# EAGLE design Adafruit SMT Datalogger Shield (EAGLE 6.4)
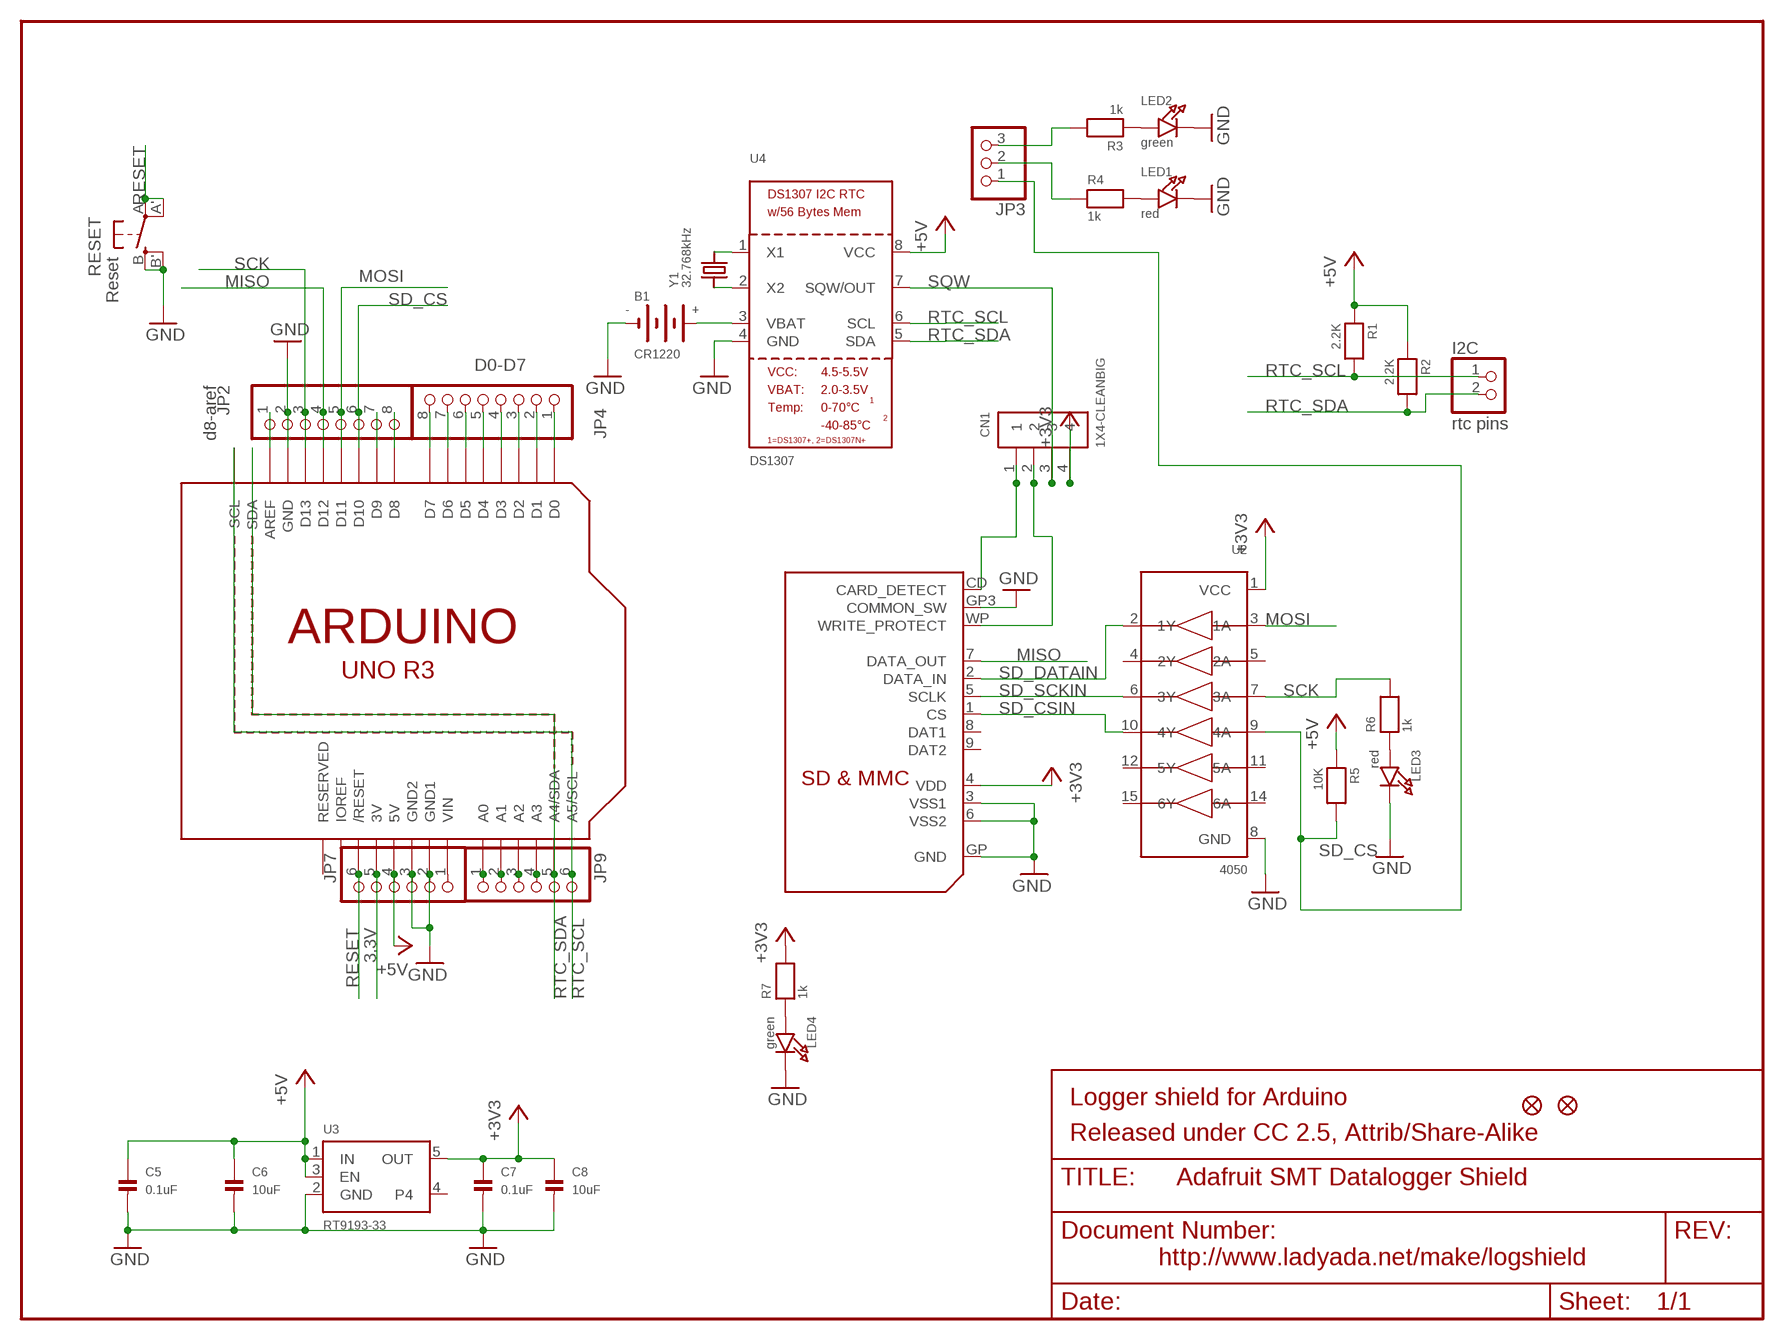
[diagram p0: schematic, sheet 1]

## Parts
B1  CR1220  BATTERYCR1220_SMT  [CR1220]
C5  0.1uF  CAP_CERAMIC0805  [0805]
C6  10uF  CAP_CERAMIC0805  [0805]
C7  0.1uF  CAP_CERAMIC0805  [0805]
C8  10uF  CAP_CERAMIC0805  [0805]
CN1  1X4-CLEANBIG  [1X04-CLEANBIG]
FID1  FIDUCIAL1X2.5  [FIDUCIAL-1X2.5]
FID3  FIDUCIAL1X2.5  [FIDUCIAL-1X2.5]
I2C  rtc pins  PINHD-1X2  [1X02]
JP2  d8-aref  PINHD-1X8BIG  [1X08-BIG]
JP3  HEADER-1X3ROUND  [1X03_ROUND]
JP4  D0-D7  PINHD-1X8BIG  [1X08-BIG]
JP7  PINHD-1X6B  [1X06-BIG]
JP9  PINHD-1X6B  [1X06-BIG]
LED1  red  LED0805  [CHIPLED_0805]
LED2  green  LED0805  [CHIPLED_0805]
LED3  red  LED0805  [CHIPLED_0805]
LED4  green  LED0805  [CHIPLED_0805]
R1  2.2K  RESISTOR0805  [0805]
R2  2.2K  RESISTOR0805  [0805]
R3  1k  RESISTOR0805  [0805]
R4  1k  RESISTOR0805  [0805]
R5  10K  RESISTOR0805  [0805]
R6  1k  RESISTOR0805  [0805]
R7  1k  RESISTOR0805  [0805]
RESET  Reset  SPST_TACT-EVQQ2  [EVQ-Q2]
U1  ARDUINOR3-DIMENSION  [ARDUINOR3]
U2  4050  74HC4050D  [SOIC16]
U3  RT9193-33  VREG_SOT23-5  [SOT23-5]
U4  DS1307  RTC_DS1307  [SOIC8_150MIL]
U$2  SDMMC06132  [06132]
Y1  32.768kHz  CRYSTAL8X3.8SMT  [CRYSTAL_8X3.8]

## Nets
3.3V: JP7.5 U1.3V
+3V3: C7.1 C8.1 CN1.4 R7.2 U2.1(VCC) U3.5(OUT) U$2.4(VDD)
+5V: C5.1 C6.1 JP7.4 R1.1 R2.1 R5.1 U1.5V U3.1(IN) U3.3(EN) U4.8(VCC)
GND: B1.- C5.2 C6.2 C7.2 C8.2 JP2.2 JP7.2 JP7.3 LED1.C LED2.C LED3.C LED4.C RESET.B'(S1) RESET.B(S) U1.GND U1.GND1 U1.GND2 U2.8(GND) U3.2(GND) U4.4(GND) U$2.3(VSS1) U$2.6(VSS2) U$2.GP3(COMMON_SW) U$2.GP(GND)
MISO: JP2.4 U1.D12 U$2.7(DATA_OUT)
MOSI: JP2.5 U1.D11 U2.3(1A)
N$1: LED1.A R4.2
N$2: U4.2(X2) Y1.P$1
N$3: U4.1(X1) Y1.P$4
N$4: LED2.A R3.1
N$5: LED3.A R6.1
N$14: B1.+$1(+) U4.3(VBAT)
N$15: JP7.1 U1.VIN
N$17: JP3.3 R3.2
N$20: JP3.2 R4.1
N$87: JP4.1 U1.D0
N$88: JP4.2 U1.D1
N$89: JP4.3 U1.D2
N$90: JP4.4 U1.D3
N$98: JP4.5 U1.D4
N$99: JP4.6 U1.D5
N$100: JP4.7 U1.D6
N$101: JP4.8 U1.D7
N$108: JP2.1 U1.AREF
N$110: JP2.7 U1.D9
N$111: JP2.8 U1.D8
N$150: LED4.A R7.1
N$154: JP9.1 U1.A0
N$164: JP9.2 U1.A1
N$181: JP9.3 U1.A2
N$182: JP9.4 U1.A3
RESET: JP7.6 RESET.A'(P1) RESET.A(P) U1.RESET(/RESET)
RTC_SCL: I2C.1 JP9.6 R1.2 U1.A5(A5/SCL) U1.SCL U4.6(SCL)
RTC_SDA: I2C.2 JP9.5 R2.2 U1.A4(A4/SDA) U1.SDA U4.5(SDA)
SCK: JP2.3 R6.2 U1.D13 U2.7(3A)
SD_CD: CN1.1 U$2.CD(CARD_DETECT)
SD_CS: JP2.6 JP3.1 R5.2 U1.D10 U2.9(4A)
SD_CSIN: U2.10(4Y) U$2.1(CS)
SD_DATAIN: U2.2(1Y) U$2.2(DATA_IN)
SD_SCKIN: U2.6(3Y) U$2.5(SCLK)
SD_WP: CN1.2 U$2.WP(WRITE_PROTECT)
SQW: CN1.3 U4.7(SQW/OUT)
Unconnected: U1.IOREF U1.RESERVED U2.4(2Y) U2.5(2A) U2.11(5A) U2.12(5Y) U2.14(6A) U2.15(6Y) U3.4 U$2.8(DAT1) U$2.9(DAT2)

## Notes on the sheet
- Logger shield for Arduino
- Released under CC 2.5, Attrib/Share-Alike
- http://www.ladyada.net/make/logshield

## Library data of the parts
B1 = microbuilder:BATTERY
C5-C8 = microbuilder:CAP_CERAMIC: Ceramic Capacitors 0402 - 0402 Surface Mount Capacitors 16pF 50V 5% [Digikey: 445-4899-2-ND] 18pF 50V 5% [Digikey: 490-1281-2-ND] 22pF 50V 5% [Digikey: 490-1283-2-ND] 68pF 50V 5% [Digikey: 490-1289-2-ND] 0.1uF 10V 10% [Digikey: 490-1318-2-ND] 1.0uF 6.3V 10% [Digikey: 490-1320-2-ND] 0603 - 0603 Surface Mount Capacitors 16 pF 50V 5% [Digikey: 445-5051-2-ND] 22 pF 50V [Digikey: PCC220ACVTR-ND] 33 pF 50V 5% [Digikey: 490-1415-1-ND] 56pF 50V 5% [Digikey: 490-1421-1-ND] 220pF 50V 5% [Digikey: 445-1285-1-ND] 680 pF 50V 2200 pF 50V 5% C0G [Digikey: 445-1297-1-ND] 5600 pF 100V 5% X7R [Digikey: 478-3711-1-ND] 0.1 µF 25V 10% [Digikey: PCC2277TR-ND] 0.22 µF 16V 10% X7R [Digikey: 445-1318-1-ND] 1.0 µF 25V 10% [Digikey: 445-5146-2-ND] 0603 - RF Specific 3pF 250V +/-0.1pF RF [Digikey: 712-1347-1-ND] 18 pF 250V 5% [Digikey: 478-3505-1-ND or 712-1322-1-ND] 56 pF 250V 5% C0G RF [Digikey: 490-4867-1-ND] 68 pF 250V RF [Digikey: 490-4868-1-ND] 0805 - 0805 Surface Mount Capacitors 220 pF 250V 2% RF Ceramic Capacitor [Digikey: 712-1398-1-ND] 1000 pF 50V 2% NP0 Ceramic Capacitor [Digikey: 478-3760-1-ND] 0.1 µF 25V 10% Ceramic Capacitor [Digikey: PCC1828TR-ND] 1.0 µF 16V 10% Ceramic Capacitor[Digikey: 490-1691-2-ND] 10.0 µF 10V 10% Ceramic Capacitor[Digikey: 709-1228-1-ND] 10.0 uF 16V 10% Ceramic Capacitor [Digikey: 478-5165-2-ND] 47 uF 6.3V 20% Ceramic Capacitor [Digikey: 587-1779-1-ND or 399-5506-1-ND] 1206 - 1206 Surface Mount Capacitors 47uF 10V 20% Ceramic Capacitor [Digikey: 490-5528-1-ND or 399-5508-1-ND or 445-6010-1-ND] 100uF 6.3V -20%, +80% Y5V Ceramic Capacitor (Digikey: 490-4512-1-ND, Mouser: 81-GRM31CF50J107ZE1L)
CN1 = adafruit:1X4: 4-pin connector
FID1 FID3 = microbuilder:FIDUCIAL: Fiducial Alignment Points Various fiducial points for machine vision alignment.
I2C = pinhead:PINHD-1X2: PIN HEADER
JP2 JP4 = adafruit:PINHD-1X8: PIN HEADER
JP3 = microbuilder:HEADER-1X3: PIN HEADER
JP7 JP9 = adafruit:PINHD-1X6: PIN HEADER
LED1-LED4 = microbuilder:LED: LED 0603 - 0603 Surface Mount Package 2mA: Green LED - Low Power (3.9mcd, 2ma, 1.7Vf) - Digikey: 475-2709-2-ND Orange LED - Low Power (9.8mcd, 2ma, 1.8Vf) - Digikey: 475-1194-2-ND Red LED - Low Power (5mcd, 2ma, 1.8Vf) - Digikey: 475-1195-2-ND Yellow LED - Low Power (7mcd, 2ma, 1.8Vf) - Digikey: 475-1196-2-ND 5mA: Blue LED - Low Power (17mcd, 5ma, 2.9Vf) - Digikey: LNJ937W8CRACT-ND 0805 - 0805 Surface Mount Package 2mA: Red LED (8.8mcd, 2mA, 1.8Vf, Clear) - Low Power [Digikey: 475-2510-1-ND] Green LED (5mcd, 2mA, 1.8Vf, Clear) - Low Power [Digikey: 475-2730-1-ND] Yellow LED (11.3mcd, 2mA, 1.8Vf, Clear) - Low Power [Digikey: 475-2555-1-ND] 20mA: Red LED (104mcd, 20mA, Diffused) - LS R976 [Digikey: 475-1278-6-ND] Red LED (12mcd, 20mA, 2.0Vf, Clear) - APT2012EC [Digikey: 754-1128-1-ND] Green LED (15mcd, 20mA, 2.2Vf, Clear) - APT2012GC [Digikey: 754-1131-1-ND] Orange LED (160mcd, 20mA, 2.1Vf, Clear) - APT2012SECK [Digikey: 754-1130-1-ND] 1206 - 1206 Surface Mount Package Green LED (26mcd, 20mA, Diffused) - LG N971 [Digikey: 475-1407-6-ND] Red LED (15mcd, 20mA, Diffused) - LH N974 [Digikey: 475-1416-6-ND]
R1-R7 = microbuilder:RESISTOR: Resistors 0402 - 0402 Surface Mount Package 22 Ohm 1% 1/16W [Digikey: 311-22.0LRTR-ND] 33 Ohm 5% 1/16W 1.0K 5% 1/16W 1.5K 5% 1/16W 2.0K 1% 1/16W 10.0K 1% 1/16W [Digikey: 311-10.0KLRTR-ND] 10.0K 5% 1/16W [Digikey: RMCF0402JT10K0TR-ND] 12.1K 1% 1/16W [Digikey: 311-22.0LRTR-ND] 100.0K 5% 1/16W 0603 - 0603 Surface Mount Package 0 Ohm 1/10 Watt 1% Resistor 15 Ohm 1/10 Watt 1% Resistor 33 Ohm 1/10 Watt 1% Resistor 49.9 Ohm 1/10 Watt 1% Resistor 100 Ohm 1/10 Watt 1% Resistor 150 Ohm 1/10 Watt 1% Resistor 240 Ohm 1/10 Watt 1% Resistor 390 Ohm 1/10 Watt 1% Resistor 560 Ohm 1/10 Watt 1% Resistor 680 Ohm 1/10 Watt 1% Resistor 750 Ohm 1/10 Watt 1% Resistor 1.0K Ohm 1/10 Watt 1% Resistor 1.5K Ohm 1/10 Watt 1% Resistor 2.0K Ohm 1/10 Watt 1% Resistor 2.2K Ohm 1/10 Watt 1% Resistor 3.3K Ohm 1/10 Watt 1% Resistor 4.7K Ohm 1/10 Watt 1% Resistor 10.0K Ohm 1/10 Watt 1% Resistor 12.0K Ohm 1/10 Watt 1% Resistor 12.1K Ohm 1/10 Watt 1% Resistor 20.0K Ohm 1/10 Watt 1% Resistor 33.0K Ohm 1/10 Watt 1% Resistor 100.0K Ohm 1/10 Watt 1% Resistor 0805 - 0805 Surface Mount Package 0 Ohm 1/8 Watt 1% Resistor 33 Ohm 1/8 Watt 1% Resistor 100 Ohm 1/8 Watt 1% Resistor 150 Ohm 1/8 Watt 1% Resistor 200 Ohm 1/8 Watt 1% Resistor 240 Ohm 1/8 Watt 1% Resistor 330 Ohm 1/8 Watt 1% Resistor 390 Ohm 1/8 Watt 1% Resistor 470 Ohm 1/8 Watt 1% Resistor 1.0K Ohm 1/8 Watt 1% Resistor 1.5K Ohm 1/8 Watt 1% Resistor 2.0K Ohm 1/8 Watt 1% Resistor 4.7K Ohm 1/8 Watt 1% Resistor 5.1K Ohm 1/8 Watt 1% Resistor 5.6K Ohm 1/8 Watt 1% Resistor 10.0K Ohm 1/8 Watt 1% Resistor 22.0K Ohm 1/8 Watt 1% Resistor 33.0K Ohm 1/8 Watt 1% Resistor 100K Ohm 1/8 Watt 1% Resistor 1206 - 1206 Surface Mount Package 2012 - 2010 Surface Mount Package 0.11 Ohm 1/2 Watt 1% Resistor - Digikey: RHM.11UCT-ND
RESET = adafruit:SPST_TACT: SMT 6mm switch, EVQQ2 series http://www.ladyada.net/library/eagle
U1 = adafruit:ARDUINOR3: This is a new object for the new Arduino R3 - with extra pins that you may want to use (such as IOref, and duplicated A4/A5
U2 = microbuilder:74HC4050D: 6-channel level shifter 74HC4050D - 2V-6V Supply Digikey: 74HC4050D,653-ND Mouser: 771-74HC4050D-T
U3 = microbuilder:VREG_SOT23-5: SOT23-5 Fixed Voltage Regulators To better organise some of the SOT23-5 fixed voltage regulators in this library, this new part was created. Part Current Out V Out V In V Dropout Digikey Part No. ADP121 150mA 3.3V 3.4-5.5V 0.09V @ 150mA ADP121-AUJZ33R7CT-ND ADP121 150mA 3.0V 3.1-5.5V 0.09V @ 150mA ADP121-AUJZ30R7CT-ND ADP122 300mA 3.3V 3.4-5.5V 0.085V @ 300mA ADP122AUJZ-3.3-R7CT-ND ADP1712 300mA 3.3V 3.5-5.5V 0.17V @ 300mA ADP1712AUJZ-3.3-R7TR-ND AP7311 (Low Cost) 150mA 3.3V 3.5-6V 0.15V @ 150mA AP7311-33WG-7DICT-ND LD39015M18R 150mA 1.8V 1.9V-5.5V 0.08V @ 100mA 497-6977-1-ND MCP1824T-3302E/OT 300mA 3.3V 3.5V-6V 0.2V @ 300mA MCP1824T-3302E/OTCT-ND MIC5205-2.5YM5 TR 150mA 2.5V 2.7-16V 0.165V @ 150mA 576-1257-2-ND MIC5205-3.0YM5 TR 150mA 3.0V 3.2V-16V 0.165V @ 150mA 576-1258-2-ND MIC5205-3.3YM5 TR 150mA 3.3V 3.5V-16V 0.165V @ 150mA 576-1259-2-ND TPS780330220 150mA 3.3V+2.2V 3.6-5.5V 250mV Max 296-23332-1-ND TDA3663/N1,135 100mA 3.3V 3.5-45V 0.18V @ 50mA 568-5343-1-ND
U4 = microbuilder:RTC_DS1307: DS1307 I2C RTC with 56-Bytes RAM
U$2 = adafruit:SDMMC: SD MMC Card holder 4UCON part #06132 - easy to solder
Y1 = microbuilder:CRYSTAL: Crystals HC49UP - Surface Mount Crystal 4.0MHz 18pF +/-30ppm Surface Mount Crystal [Digikey: 535-9857-1-ND] 12.0 MHz Surface Mount Crystal [Digikey: 535-9869-6-ND] 25.0 MHz Surface Mount Crystal [Digikey: 535-9078-1-ND] 3.2 x 2.5mm - MEMs SMT Crystal 12.0 MHz 8pF 15ppm 3.2 x 2.5mm Crystal [Digikey: -10-70°C: 644-1047-1-ND -40-125°C: 644-1128-1-ND] 16.0 MHz 8pF 15ppm 3.2 x 2.5mm Crystal [Digikey: -10-70°C: 644-1049-1-ND -40-125°C: 644-1129-2-ND] 16.0 MHz 10pF 10ppm 3.2 x 2.5mm Crystal [Digikey: 644-1100-1-ND] 27.12 MHz 18pF 30ppm 3.2 x 2.5mm Crystal [Digikey: 887-1424-1-ND] 27.12MHz 10pF 10ppm 3.2 x 2.5mm Crystal [Digikey: 887-1329-1-ND] 4.9 x 1.8mm - MEMs SMT Crystal 32.768 KHz 12.5pF 20ppm 4.9 x 1.8mm Crystal [Digikey: SE2415CT-ND] 8.0 x 3.8mm - Surface Mount Crystal 32.768kHz 12.5pF 20ppm -40°C-85°C [Digikey: 535-9166-2-ND] Cylinder 32.768KHz Cylinder Crystal (2x6mm body) [Ex. Digikey: 300-8341-2-ND]

## Board
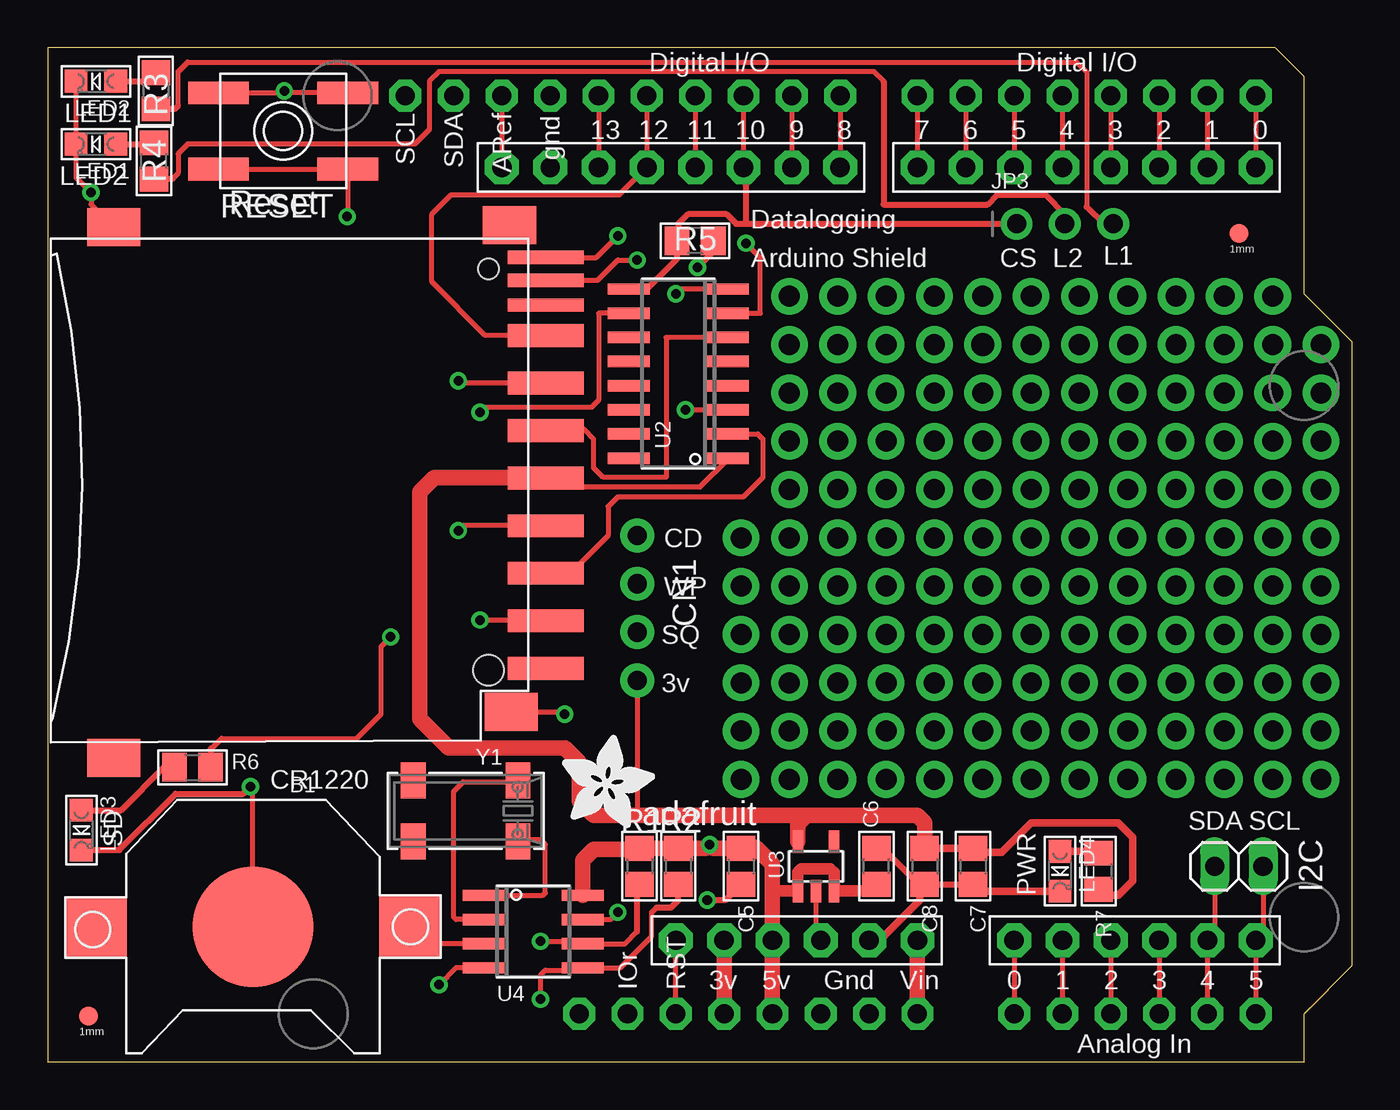
[diagram p1: board, top side]
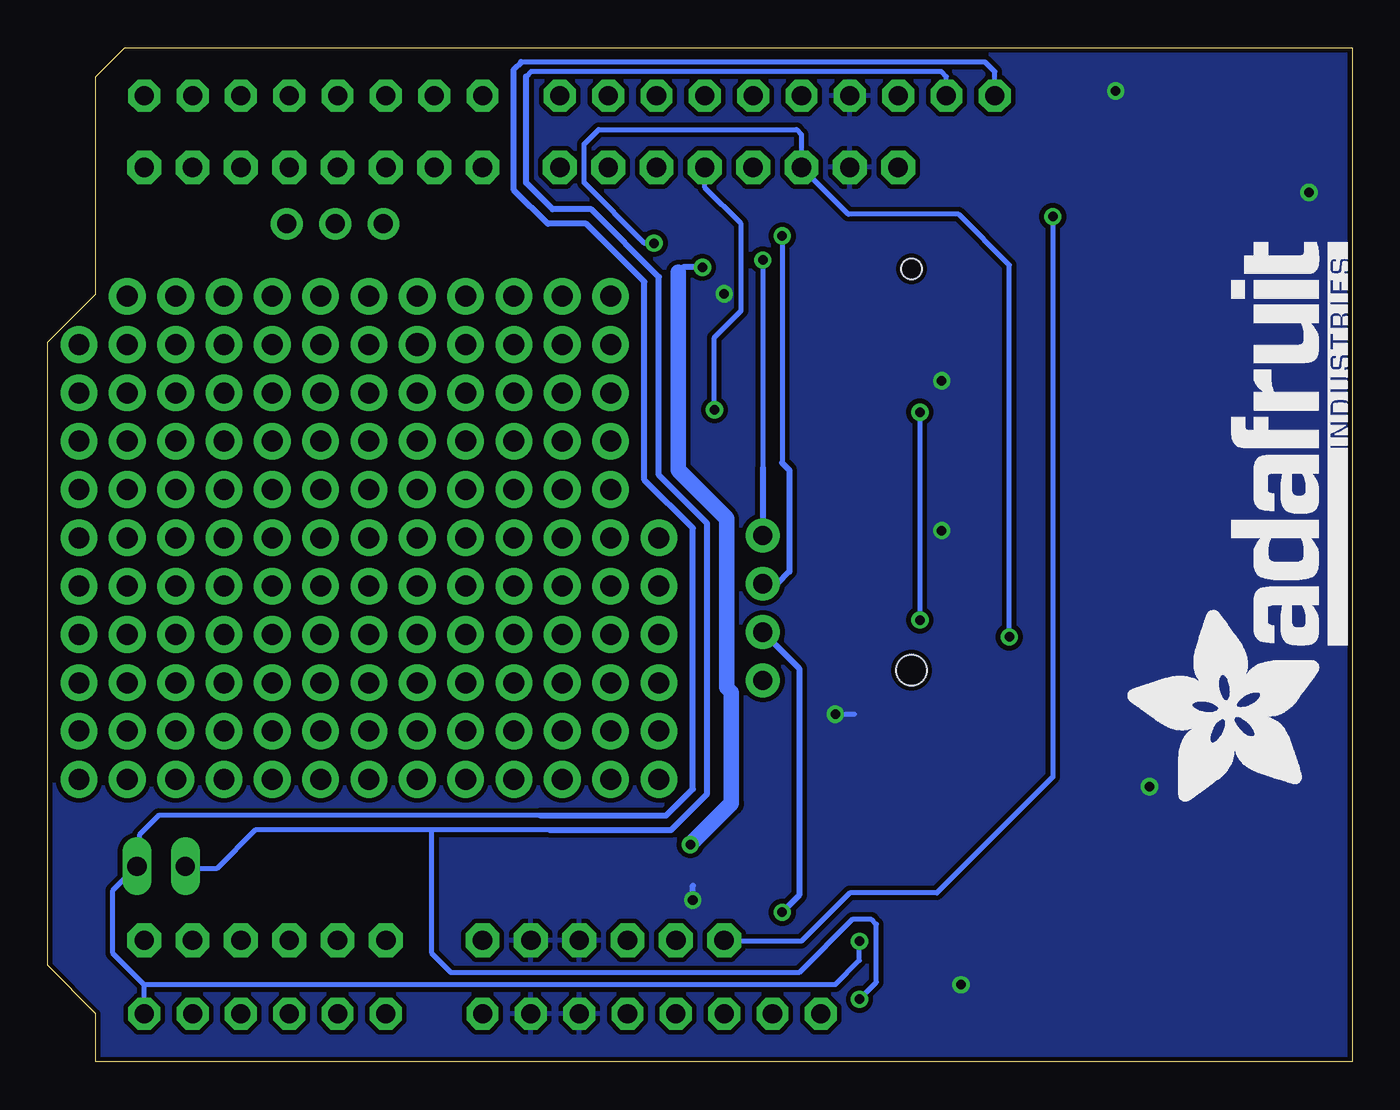
[diagram p2: board, bottom side, seen from below]

Size 68.58 x 53.34 mm. Coordinates in mm from the lower left corner, seen from the top.
Copper layers (1*16): Top 0.035mm / dielectric 1.5mm / Bottom 0.035mm
Design rules "default": minimum track width 10mil, minimum drill 19mil, track to track 10mil, track to pad 10mil, pad to pad 10mil, via to via 10mil, smd to smd 8mil, copper to edge 10mil, drill to drill 8mil, minimum pad ring 10mil, minimum via ring 8mil, stop-mask expansion 4mil, vias tented up to drill 20mil, thermal gap 10mil

### Footprints (pad centres in the part's own frame; a part is rotated, then mirrored left to right if it is on the bottom)
CR1220 = smd 3.2 x 3.2: +$1 -8.225,0; +$2 8.225,0 | smd 6.35 x 6.35: - 0,0
0805 = smd 1.3 x 1.5: 1 -0.95,0; 2 0.95,0
1X04-CLEANBIG = drill 1.016 pad 1.778: 1 -3.81,0; 2 -1.27,0; 3 1.27,0; 4 3.81,0
FIDUCIAL-1X2.5 = smd 1 x 1: 1 0,0
1X02 = drill 1.016 long: 1 -1.27,0; 2 1.27,0
1X08-BIG = drill 1.016 pad 1.778 octagon: 1 -8.89,0; 2 -6.35,0; 3 -3.81,0; 4 -1.27,0; 5 1.27,0; 6 3.81,0; 7 6.35,0; 8 8.89,0
1X03_ROUND = drill 1 pad 1.676: 1 -2.54,0; 2 0,0; 3 2.54,0
1X06-BIG = drill 1.016 pad 1.778 octagon: 1 -6.35,0; 2 -3.81,0; 3 -1.27,0; 4 1.27,0; 5 3.81,0; 6 6.35,0
CHIPLED_0805 = smd 1.2 x 1.2: A 0,-1.05; C 0,1.05
EVQ-Q2 = smd 3.2 x 1.2: A -3.4,-2; A' 3.4,-2; B -3.4,2; B' 3.4,2
ARDUINOR3 = drill 1 pad 1.676 octagon: 3V 35.56,2.54; 5V 38.1,2.54; A0 50.8,2.54; A1 53.34,2.54; A2 55.88,2.54; A3 58.42,2.54; A4 60.96,2.54; A5 63.5,2.54; AREF 23.876,50.8; D0 63.5,50.8; D1 60.96,50.8; D2 58.42,50.8; D3 55.88,50.8; D4 53.34,50.8; D5 50.8,50.8; D6 48.26,50.8; D7 45.72,50.8; D8 41.656,50.8; D9 39.116,50.8; D10 36.576,50.8; D11 34.036,50.8; D12 31.496,50.8; D13 28.956,50.8; GND 26.416,50.8; GND1 43.18,2.54; GND2 40.64,2.54; IOREF 30.48,2.54; RESERVED 27.94,2.54; RESET 33.02,2.54; SCL 18.796,50.8; SDA 21.336,50.8; VIN 45.72,2.54
SOIC16 = smd 0.6 x 2.2: 1 -4.445,-2.6; 2 -3.175,-2.6; 3 -1.905,-2.6; 4 -0.635,-2.6; 5 0.635,-2.6; 6 1.905,-2.6; 7 3.175,-2.6; 8 4.445,-2.6; 9 4.445,2.6; 10 3.175,2.6; 11 1.905,2.6; 12 0.635,2.6; 13 -0.635,2.6; 14 -1.905,2.6; 15 -3.175,2.6; 16 -4.445,2.6
SOT23-5 = smd 0.55 x 1.2: 1 -0.95,-1.3; 2 0,-1.3; 3 0.95,-1.3; 4 0.95,1.3; 5 -0.95,1.3
SOIC8_150MIL = smd 0.6 x 2.2: 1 -1.905,-2.6; 2 -0.635,-2.6; 3 0.635,-2.6; 4 1.905,-2.6; 5 1.905,2.6; 6 0.635,2.6; 7 -0.635,2.6; 8 -1.905,2.6
06132 = smd 1.2 x 4: 1 6.9,0.9; 2 4.4,0.9; 3 1.9,0.9; 4 -0.6,0.9; 5 -3.1,0.9; 6 -5.6,0.9; 7 -8.1,0.9; 9 9.4,0.9 | smd 0.7 x 4: 8 -9.7,0.9; CD -11,0.9; WP -12.2,0.9 | smd 2 x 2.8: GP -13.8,-21.8; GP2 14.1,-21.8; GP3 11.7,-0.9; GP4 -13.9,-1 | hole 1.1: -11.6,-2.1 | hole 1.6: 9.5,-2.1
CRYSTAL_8X3.8 = smd 1.3 x 1.9: P$1 -2.75,-1.6; P$2 2.75,-1.6; P$3 2.75,1.6; P$4 -2.75,1.6

### Placement (x,y rotation side)
B1  10.79,7.11 180 top
C5  36.45,10.29 270 top
C6  43.56,10.29 90 top
C7  48.64,10.29 270 top
C8  46.1,10.29 270 top
CN1  30.99,23.88 270 top
FID1  2.16,2.41 0 top
FID3  62.61,43.56 0 top
I2C  62.61,10.29 180 top
JP2  32.77,47.04 0 top
JP3  53.47,44.07 0 top
JP4  54.61,47.04 180 top
JP7  39.37,6.4 180 top
JP9  57.15,6.4 0 top
LED1  2.54,48.26 90 top
LED2  2.54,51.56 90 top
LED3  1.78,12.19 180 top
LED4  53.21,10.03 180 top
R1  31.11,10.29 270 top
R2  33.15,10.29 270 top
R3  5.69,51.06 270 top
R4  5.59,47.37 90 top
R5  34.04,43.18 180 top
R6  7.62,15.49 0 top
R7  55.24,10.03 270 top
RESET  12.39,48.95 0 top
U1  0,0 0 top
U2  33.15,36.2 90 top
U3  40.39,10.29 0 top
U4  25.53,6.86 270 top
U$1  [ADAFRUIT_TEXT_30MM]  0.25,13.46 90 bottom
U$2  25.27,30.1 270 top
U$5  [ADAFRUIT_5MM]  27.05,12.32 0 top
Y1  21.97,13.21 180 top

### Tracks (layer width: path | path; a pad name or v marks a point on that pad's centre or on a via)
3.3V
  Top 0.813: JP7.5 U1.3V
+3V3
  Top 0.254: 26.21,30.73 24.43,30.73 | CN1.4 30.99,13.08 30.86,12.95 | 26.21,30.73 27.18,30.73 27.69,30.23 34.29,30.23 35.75,31.68 U2.1 | 26.21,30.73 U$2.4
  Top 0.406: C8.1 C7.1 48.84,11.03 50.15,11.03 51.69,12.57 56.26,12.57 57.02,11.81 57.02,9.53 56.26,8.76 55.56,8.76 R7.2
  Top 0.813: 39.88,12.95 45.72,12.95 46.1,12.57 C8.1 | 39.88,12.95 39.44,12.51 U3.5 | 24.43,30.73 20.32,30.73 19.56,29.97 19.56,18.03 21.08,16.51 27.18,16.51 27.94,15.75 27.94,13.72 28.7,12.95 30.86,12.95 39.88,12.95
+5V  (via drill 0.5)
  Top 0.305: v34.16,41.78 35.04,42.66 35.04,43.13 R5.1 | 37.22,11.29 37.17,11.24 C5.1 | 31,11.18 31.05,11.18 R1.1
  Top 0.61: 38.2,8.99 U3.1 39.44,9.97 39.62,10.16 41.15,10.16 41.34,9.97 U3.3 43.21,8.99 C6.1
  Top 0.813: U1.5V JP7.4 38.1,8.89 | U4.8 28.13,10.6 28.7,11.18 31,11.18 | R1.1 R2.1 34.6,11.24 v34.8,11.43 34.99,11.24 C5.1 | 38.1,8.89 38.1,10.41 37.22,11.29 | 38.2,8.99 38.1,8.89
  Bottom 0.305: v34.16,41.78 35.18,41.78 35.43,41.53
  Bottom 0.813: v34.8,11.43 32.64,13.59 32.64,19.43 32.89,19.68 32.89,28.57 35.43,31.11 35.43,41.53
GND  (via drill 0.5)
  Top 0.254: U$2.6 21.7,35.7 v21.59,35.81 | U$2.3 21.85,28.2 v21.59,27.94 | U$2.GP3 27.07,18.4 v27.18,18.29 | B1.- 10.79,14.35 v10.67,14.48 | U4.4 21.46,4.95 v20.57,4.06 | U3.2 40.39,6.66 JP7.3 | U2.8 33.27,40.64 v33.02,40.39 | LED2.C LED1.C 1.49,46.52 v2.29,45.72 2.29,45.09 U$2.GP | RESET.B 12.35,50.95 v12.45,51.05 12.55,50.95 RESET.B'
  Top 0.305: LED3.C 3.78,11.14 6.73,14.1 10.29,14.1 v10.67,14.48 | C5.2 35.62,8.51 v34.67,8.51 | C7.2 C8.2 45.78,9.66 45.46,9.66 44.07,11.05 43.75,11.05 C6.2
  Top 0.406: 53.16,9.03 LED4.C 48.99,8.98 C7.2 | JP7.2 43.74,6.4 45.85,8.51 45.85,9.08 C8.2
  Bottom 0.254: v2.29,45.72 2.54,45.72 | v21.59,35.81 21.34,35.81 | v21.59,27.94 21.59,27.69 | v27.18,18.29 26.16,18.29 | v10.67,14.48 10.67,14.73 | v20.57,4.06 20.57,3.81 | v12.45,51.05 12.7,51.05
  Bottom 0.305: v34.67,8.51 34.67,9.27
  pour Bottom (isolate 0.254): 0,0 0,53.34 68.58,53.34 68.58,0
MISO
  Top 0.254: U1.D12 JP2.4 30.05,45.59 21.21,45.59 20.19,44.58 20.19,41.02 23.02,38.2 U$2.7
MOSI  (via drill 0.5)
  Top 0.254: U1.D11 JP2.5 | U2.3 v33.53,34.29
  Bottom 0.254: v33.53,34.29 33.53,38.1 32.13,39.5 32.13,44.07 34.04,45.97 JP2.5
N$1
  Top 0.305: LED1.A 5.53,48.26 R4.2
N$2
  Top 0.254: U4.2 21.46,7.49 21.34,7.62 21.34,14.22 21.84,14.73 24.64,14.73 Y1.P$1
N$3
  Top 0.254: U4.1 26.04,8.76 26.16,8.89 26.16,11.43 25.91,11.68 24.8,11.68 Y1.P$4
N$4
  Top 0.305: LED2.A 5.24,51.56 R3.1
N$5
  Top 0.305: LED3.A 3.86,13.24 6.11,15.49 R6.1
N$6  (via drill 1.1 pad 1.93)
  other vias: 51.69,37.72
N$7  (via drill 1.1 pad 1.93)
  other vias: 46.61,37.72
N$8  (via drill 1.1 pad 1.93)
  other vias: 44.07,35.18
N$9  (via drill 1.1 pad 1.93)
  other vias: 54.23,37.72
N$10  (via drill 1.1 pad 1.93)
  other vias: 44.07,32.64
N$11  (via drill 1.1 pad 1.93)
  other vias: 56.77,35.18
N$12  (via drill 1.1 pad 1.93)
  other vias: 44.07,17.4
N$13  (via drill 1.1 pad 1.93)
  other vias: 61.85,32.64
N$14
  Top 0.254: U4.3 19.91,6.22 B1.+$1
N$15
  Top 0.813: JP7.1 U1.VIN
N$16  (via drill 1.1 pad 1.93)
  other vias: 56.77,37.72
N$17
  Top 0.254: 6.86,50.29 6.86,52.07 7.37,52.58 54.1,52.58 54.61,52.07 54.61,44.96
  Top 0.305: 54.61,44.96 55.5,44.07 JP3.3 | 6.86,50.29 6.68,50.11 R3.2
N$18  (via drill 1.1 pad 1.93)
  other vias: 44.07,30.1
N$19  (via drill 1.1 pad 1.93)
  other vias: 59.31,37.72
N$20
  Top 0.254: 43.94,51.56 43.43,52.07 20.57,52.07 20.07,51.56 20.07,49.02 19.3,48.26 7.37,48.26 6.86,47.75 6.86,46.74 6.6,46.48
  Top 0.305: 43.94,51.56 43.94,45.09 49.4,45.09 49.91,45.59 52.45,45.59 53.47,44.58 JP3.2 | 6.6,46.48 6.54,46.42 R4.1
N$21  (via drill 1.1 pad 1.93)
  other vias: 61.85,30.1
N$22  (via drill 1.1 pad 1.93)
  other vias: 61.85,27.56
N$23  (via drill 1.1 pad 1.93)
  other vias: 61.85,25.02
N$24  (via drill 1.1 pad 1.93)
  other vias: 61.85,35.18
N$25  (via drill 1.1 pad 1.93)
  other vias: 59.31,35.18
N$26  (via drill 1.1 pad 1.93)
  other vias: 64.39,25.02
N$27  (via drill 1.1 pad 1.93)
  other vias: 54.23,35.18
N$28  (via drill 1.1 pad 1.93)
  other vias: 51.69,35.18
N$29  (via drill 1.1 pad 1.93)
  other vias: 49.15,35.18
N$30  (via drill 1.1 pad 1.93)
  other vias: 46.61,35.18
N$31  (via drill 1.2 pad 1.93)
  other vias: 49.15,37.72
N$32  (via drill 1.1 pad 1.93)
  other vias: 49.15,32.64
N$33  (via drill 1.1 pad 1.93)
  other vias: 51.69,32.64
N$34  (via drill 1.1 pad 1.93)
  other vias: 54.23,32.64
N$35  (via drill 1.1 pad 1.93)
  other vias: 56.77,32.64
N$36  (via drill 1.1 pad 1.93)
  other vias: 59.31,32.64
N$37  (via drill 1.1 pad 1.93)
  other vias: 61.85,14.86
N$38  (via drill 1.1 pad 1.93)
  other vias: 64.39,37.72
N$39  (via drill 1.1 pad 1.93)
  other vias: 66.93,25.02
N$40  (via drill 1.1 pad 1.93)
  other vias: 66.93,27.56
N$41  (via drill 1.1 pad 1.93)
  other vias: 64.39,17.4
N$42  (via drill 1.1 pad 1.93)
  other vias: 46.61,30.1
N$43  (via drill 1.1 pad 1.93)
  other vias: 49.15,30.1
N$44  (via drill 1.1 pad 1.93)
  other vias: 51.69,30.1
N$45  (via drill 1.1 pad 1.93)
  other vias: 54.23,30.1
N$46  (via drill 1.1 pad 1.93)
  other vias: 56.77,30.1
N$47  (via drill 1.1 pad 1.93)
  other vias: 59.31,30.1
N$48  (via drill 1.1 pad 1.93)
  other vias: 64.39,30.1
N$49  (via drill 1.1 pad 1.93)
  other vias: 64.39,14.86
N$50  (via drill 1.1 pad 1.93)
  other vias: 66.93,30.1
N$51  (via drill 1.1 pad 1.93)
  other vias: 54.23,14.86
N$52  (via drill 1.1 pad 1.93)
  other vias: 64.39,32.64
N$53  (via drill 1.1 pad 1.93)
  other vias: 66.93,14.86
N$54  (via drill 1.1 pad 1.93)
  other vias: 66.93,17.4
N$55  (via drill 1.1 pad 1.93)
  other vias: 64.39,27.56
N$56  (via drill 1.1 pad 1.93)
  other vias: 59.31,27.56
N$57  (via drill 1.1 pad 1.93)
  other vias: 56.77,27.56
N$58  (via drill 1.1 pad 1.93)
  other vias: 54.23,27.56
N$59  (via drill 1.1 pad 1.93)
  other vias: 51.69,27.56
N$60  (via drill 1.1 pad 1.93)
  other vias: 49.15,27.56
N$61  (via drill 1.1 pad 1.93)
  other vias: 46.61,27.56
N$62  (via drill 1.1 pad 1.93)
  other vias: 66.93,22.48
N$63  (via drill 1.1 pad 1.93)
  other vias: 66.93,19.94
N$64  (via drill 1.1 pad 1.93)
  other vias: 61.85,19.94
N$65  (via drill 1.1 pad 1.93)
  other vias: 64.39,22.48
N$66  (via drill 1.1 pad 1.93)
  other vias: 46.61,25.02
N$67  (via drill 1.1 pad 1.93)
  other vias: 49.15,25.02
N$68  (via drill 1.1 pad 1.93)
  other vias: 51.69,25.02
N$69  (via drill 1.1 pad 1.93)
  other vias: 54.23,25.02
N$70  (via drill 1.1 pad 1.93)
  other vias: 56.77,25.02
N$71  (via drill 1.1 pad 1.93)
  other vias: 59.31,25.02
N$72  (via drill 1.1 pad 1.93)
  other vias: 66.93,35.18
N$73  (via drill 1.1 pad 1.93)
  other vias: 66.93,32.64
N$74  (via drill 1.1 pad 1.93)
  other vias: 61.85,37.72
N$75  (via drill 1.1 pad 1.93)
  other vias: 59.31,14.86
N$76  (via drill 1.1 pad 1.93)
  other vias: 56.77,14.86
N$77  (via drill 1.1 pad 1.93)
  other vias: 49.15,14.86
N$78  (via drill 1.1 pad 1.93)
  other vias: 46.61,22.48
N$79  (via drill 1.1 pad 1.93)
  other vias: 49.15,22.48
N$80  (via drill 1.1 pad 1.93)
  other vias: 51.69,22.48
N$81  (via drill 1.1 pad 1.93)
  other vias: 54.23,22.48
N$82  (via drill 1.1 pad 1.93)
  other vias: 56.77,22.48
N$83  (via drill 1.1 pad 1.93)
  other vias: 59.31,22.48
N$84  (via drill 1.1 pad 1.93)
  other vias: 61.85,22.48
N$85  (via drill 1.1 pad 1.93)
  other vias: 46.61,14.86
N$86  (via drill 1.1 pad 1.93)
  other vias: 51.69,14.86
N$87
  Top 0.254: U1.D0 JP4.1
N$88
  Top 0.254: U1.D1 JP4.2
N$89
  Top 0.254: U1.D2 JP4.3
N$90
  Top 0.254: U1.D3 JP4.4
N$91  (via drill 1.1 pad 1.93)
  other vias: 64.39,19.94
N$92  (via drill 1.1 pad 1.93)
  other vias: 59.31,19.94
N$93  (via drill 1.1 pad 1.93)
  other vias: 56.77,19.94
N$94  (via drill 1.1 pad 1.93)
  other vias: 54.23,19.94
N$95  (via drill 1.1 pad 1.93)
  other vias: 51.69,19.94
N$96  (via drill 1.1 pad 1.93)
  other vias: 49.15,19.94
N$97  (via drill 1.1 pad 1.93)
  other vias: 46.61,19.94
N$98
  Top 0.254: U1.D4 JP4.5
N$99
  Top 0.254: U1.D5 JP4.6
N$100
  Top 0.254: U1.D6 JP4.7
N$101
  Top 0.254: U1.D7 JP4.8
N$102  (via drill 1.1 pad 1.93)
  other vias: 46.61,17.4
N$103  (via drill 1.1 pad 1.93)
  other vias: 49.15,17.4
N$104  (via drill 1.1 pad 1.93)
  other vias: 51.69,17.4
N$105  (via drill 1.1 pad 1.93)
  other vias: 54.23,17.4
N$106  (via drill 1.1 pad 1.93)
  other vias: 56.77,17.4
N$107  (via drill 1.1 pad 1.93)
  other vias: 59.31,17.4
N$108
  Top 0.254: U1.AREF JP2.1
N$109  (via drill 1.1 pad 1.93)
  other vias: 61.85,17.4
N$110
  Top 0.254: U1.D9 JP2.7
N$111
  Top 0.254: U1.D8 JP2.8
N$112  (via drill 1.1 pad 1.93)
  other vias: 44.07,27.56
N$113  (via drill 1.1 pad 1.93)
  other vias: 44.07,25.02
N$114  (via drill 1.1 pad 1.93)
  other vias: 44.07,22.48
N$115  (via drill 1.1 pad 1.93)
  other vias: 44.07,19.94
N$116  (via drill 1.1 pad 1.93)
  other vias: 44.07,14.86
N$117  (via drill 1.1 pad 1.93)
  other vias: 64.39,35.18
N$118  (via drill 1.1 pad 1.93)
  other vias: 44.07,37.72
N$119  (via drill 1.1 pad 1.93)
  other vias: 41.53,35.18
N$120  (via drill 1.1 pad 1.93)
  other vias: 41.53,32.64
N$121  (via drill 1.1 pad 1.93)
  other vias: 41.53,30.1
N$122  (via drill 1.1 pad 1.93)
  other vias: 41.53,27.56
N$123  (via drill 1.1 pad 1.93)
  other vias: 41.53,25.02
N$124  (via drill 1.1 pad 1.93)
  other vias: 41.53,22.48
N$125  (via drill 1.1 pad 1.93)
  other vias: 41.53,19.94
N$126  (via drill 1.1 pad 1.93)
  other vias: 41.53,17.4
N$127  (via drill 1.1 pad 1.93)
  other vias: 41.53,14.86
N$128  (via drill 1.1 pad 1.93)
  other vias: 38.99,17.4
N$129  (via drill 1.1 pad 1.93)
  other vias: 38.99,19.94
N$130  (via drill 1.1 pad 1.93)
  other vias: 38.99,22.48
N$131  (via drill 1.1 pad 1.93)
  other vias: 38.99,25.02
N$132  (via drill 1.1 pad 1.93)
  other vias: 38.99,27.56
N$133  (via drill 1.1 pad 1.93)
  other vias: 36.45,27.56
N$134  (via drill 1.1 pad 1.93)
  other vias: 36.45,25.02
N$135  (via drill 1.1 pad 1.93)
  other vias: 36.45,22.48
N$136  (via drill 1.1 pad 1.93)
  other vias: 36.45,19.94
N$137  (via drill 1.1 pad 1.93)
  other vias: 36.45,17.4
N$138  (via drill 1.1 pad 1.93)
  other vias: 64.39,40.26
N$139  (via drill 1.1 pad 1.93)
  other vias: 61.85,40.26
N$140  (via drill 1.1 pad 1.93)
  other vias: 59.31,40.26
N$141  (via drill 1.1 pad 1.93)
  other vias: 56.77,40.26
N$142  (via drill 1.1 pad 1.93)
  other vias: 54.23,40.26
N$143  (via drill 1.1 pad 1.93)
  other vias: 51.69,40.26
N$144  (via drill 1.1 pad 1.93)
  other vias: 49.15,40.26
N$145  (via drill 1.1 pad 1.93)
  other vias: 46.61,40.26
N$146  (via drill 1.1 pad 1.93)
  other vias: 44.07,40.26
N$147  (via drill 1.1 pad 1.93)
  other vias: 41.53,40.26
N$148  (via drill 1.1 pad 1.93)
  other vias: 38.99,30.1
N$149  (via drill 1.1 pad 1.93)
  other vias: 66.93,37.72
N$150
  Top 0.406: LED4.A 55.15,11.08 R7.1
N$151  (via drill 1.1 pad 1.93)
  other vias: 38.99,40.26
N$152  (via drill 1.1 pad 1.93)
  other vias: 38.99,37.72
N$153  (via drill 1.1 pad 1.93)
  other vias: 38.99,35.18
N$154
  Top 0.254: JP9.1 U1.A0
N$155  (via drill 1.1 pad 1.93)
  other vias: 38.99,32.64
N$156  (via drill 1.1 pad 1.93)
  other vias: 46.61,32.64
N$157  (via drill 1.1 pad 1.93)
  other vias: 38.99,14.86
N$158  (via drill 1.1 pad 1.93)
  other vias: 36.45,14.86
N$159  (via drill 1.1 pad 1.93)
  other vias: 41.53,37.72
N$164
  Top 0.254: JP9.2 U1.A1
N$181
  Top 0.254: JP9.3 U1.A2
N$182
  Top 0.254: JP9.4 U1.A3
RESET  (via drill 0.5)
  Top 0.254: RESET.A RESET.A' 15.79,44.49 v15.75,44.45 | U1.RESET JP7.6
  Bottom 0.254: v15.75,44.45 15.75,14.99 21.84,8.89 26.42,8.89 28.96,6.35 32.97,6.35 JP7.6
RTC_SCL  (via drill 0.5)
  Top 0.254: I2C.1 63.88,6.78 JP9.6 U1.A5 | 30.99,6.86 30.35,6.22 U4.6 28,6.35 v25.91,6.35
  Top 0.305: 30.99,6.86 30.99,9.21 R1.2
  Bottom 0.254: U1.A5 63.5,4.06 | v25.91,6.35 25.91,5.33 27.18,4.06 63.5,4.06 | U1.SCL 18.8,52.07 19.3,52.58 43.69,52.58 | 42.67,12.95 62.74,12.95 63.75,11.94 63.75,10.41 I2C.1 65.15,9.02 65.15,5.71 63.5,4.06
  Bottom 0.305: 42.67,12.95 36.07,12.95 34.67,14.35 34.67,28.07 37.21,30.61 37.21,41.02 40.26,44.07 42.29,44.07 44.07,45.85 44.07,52.2 43.69,52.58
RTC_SDA  (via drill 0.5)
  Top 0.254: I2C.2 61.34,6.78 JP9.5 U1.A4 | 32,8.13 31.75,7.87 31.75,6.6 30.1,4.95 U4.5 28,4.83 26.16,4.83 25.91,4.57 v25.91,3.3
  Top 0.305: 32,8.13 32.77,8.13 33.15,8.51 R2.2
  Bottom 0.254: U1.SDA 21.34,51.82 21.59,52.07 43.18,52.07 43.43,51.82 | 42.16,12.19 48.39,12.19 | 48.39,12.19 57.66,12.19 59.69,10.16 61.21,10.16 I2C.2 | v25.91,3.3 25.02,4.19 25.02,7.24 25.27,7.49 26.29,7.49 29.08,4.7 47.37,4.7 48.39,5.71 48.39,12.19
  Bottom 0.305: 42.16,12.19 35.81,12.19 33.91,14.1 33.91,28.32 36.45,30.86 36.45,41.27 40.01,44.83 42.04,44.83 43.43,46.23 43.43,51.82
SCK  (via drill 0.5)
  Top 0.254: U1.D13 JP2.3 | 8.62,16.49 9.14,17.02 16.26,17.02 17.53,18.29 17.53,21.84 v18.03,22.35 | U2.7 37.47,39.37 37.47,42.29 v36.7,43.05
  Top 0.305: 8.62,16.49 8.57,16.44 R6.2
  Bottom 0.254: v36.7,43.05 37.21,43.05 40.39,46.23 40.39,48.26 39.62,49.02 29.21,49.02 28.96,48.77 JP2.3 26.49,44.58 20.7,44.58 18.03,41.91 v18.03,22.35
SD_CD  (via drill 0.5)
  Top 0.254: U$2.CD 28.91,41.1 29.97,42.16 v30.99,42.16
  Bottom 0.254: v30.99,42.16 30.99,31.24
  Bottom 0.305: 30.99,31.24 CN1.1
SD_CS
  Top 0.254: U1.D10 JP2.6
  Top 0.305: 36.7,44.07 36.2,44.07 35.69,44.58 33.66,44.58 33.15,44.07 33.15,43.24 R5.2 33.09,42.23 31.5,40.64 U2.9 | 36.7,44.07 JP3.1 | JP2.6 36.7,46.91 36.7,44.07
SD_CSIN  (via drill 0.5)
  Top 0.254: U2.10 28.96,39.37 28.96,34.8 28.57,34.42 22.99,34.42 v22.73,34.16 | v22.73,23.24 26.13,23.24 U$2.1
  Bottom 0.254: v22.73,34.16 v22.73,23.24
SD_DATAIN
  Top 0.254: U2.2 37.34,33.02 37.59,32.77 37.59,30.73 36.58,29.72 29.97,29.72 29.46,29.21 29.46,27.69 27.43,25.65 25.27,25.65 | 25.27,25.65 24.95,25.65 | U$2.2 25.32,25.7 25.27,25.65
SD_SCKIN
  Top 0.254: U2.6 32.51,38.1 32.51,30.73 29.21,30.73 28.7,31.24 28.7,32.77 28.19,33.27 26.25,33.27 U$2.5
SD_WP  (via drill 0.5)
  Top 0.254: U$2.WP 28.84,42.3 v29.97,43.43
  Bottom 0.254: v29.97,43.43 29.97,31.5
  Bottom 0.305: 29.97,31.5 29.59,31.11 29.59,25.78 30.23,25.15 CN1.2
SQW  (via drill 0.5)
  Top 0.254: U4.7 29.59,7.49 v29.97,7.87
  Bottom 0.254: v29.97,7.87 29.72,8.13
  Bottom 0.305: CN1.3 29.08,20.7 29.08,8.76 v29.97,7.87

### Text on the board
tPlace: LED1 | LED2 | Reset | Datalogging | Arduino Shield | CS | L2 | L1 | CD | WP | SQ | 3v | CR1220 | adafruit | SDA | SCL | SD | PWR